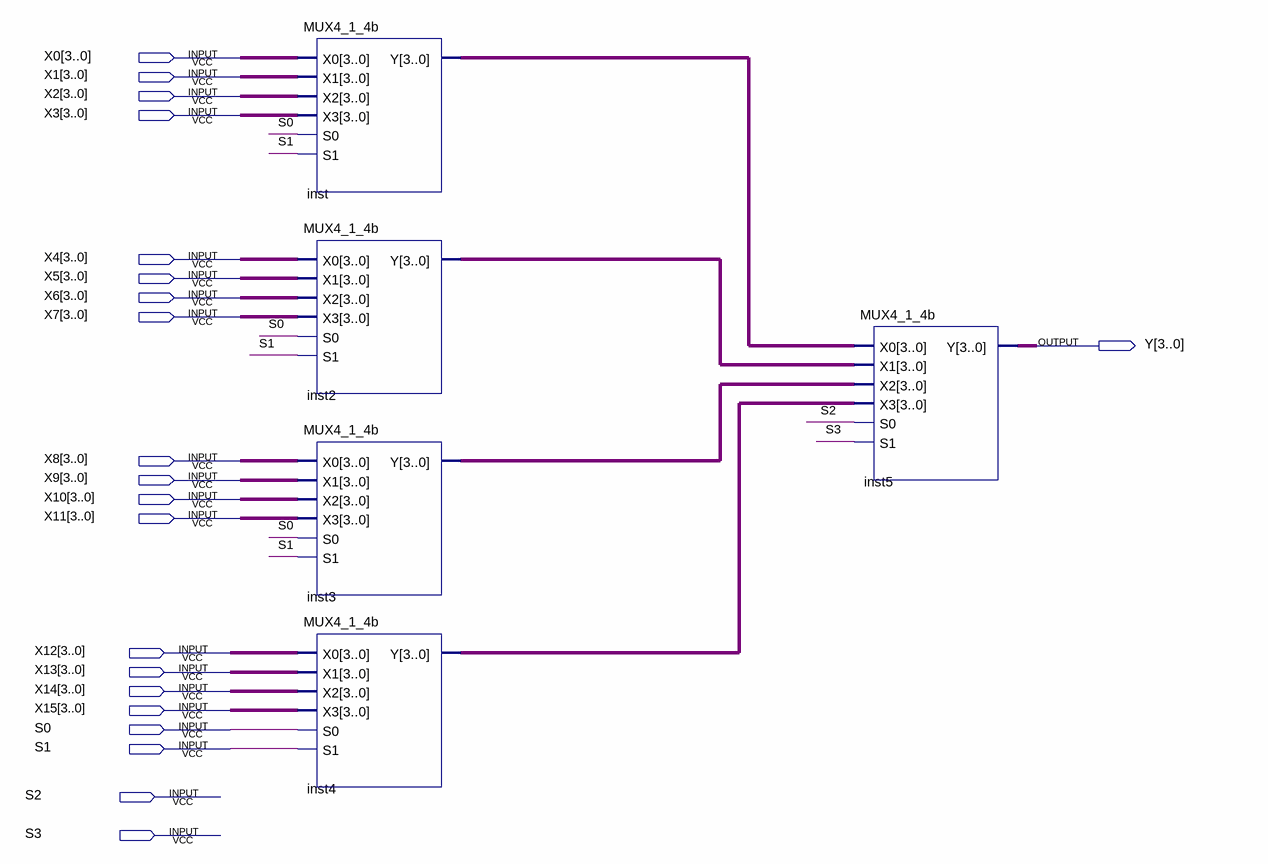
[diagram p0: schematic sheet]
// Quartus schematic MUX16_1_4b.bdf as structural Verilog: 5 symbols, 21 pins
module MUX16_1_4b (
  input  [3:0] X0,
  input  [3:0] X1,
  input  [3:0] X2,
  input  [3:0] X3,
  input  [3:0] X4,
  input  [3:0] X5,
  input  [3:0] X6,
  input  [3:0] X7,
  input  [3:0] X8,
  input  [3:0] X9,
  input  [3:0] X10,
  input  [3:0] X11,
  input  [3:0] X12,
  input  [3:0] X13,
  input  [3:0] X14,
  input  [3:0] X15,
  input  S0,
  input  S1,
  input  S2,
  input  S3,
  output [3:0] Y
);

  wire [3:0] inst2_y, inst3_y, inst4_y, inst_y;

  MUX4_1_4b inst (.X0(X0), .X1(X1), .X2(X2), .X3(X3), .S0(S0), .S1(S1), .Y(inst_y));
  MUX4_1_4b inst2 (.X0(X4), .X1(X5), .X2(X6), .X3(X7), .S0(S0), .S1(S1), .Y(inst2_y));
  MUX4_1_4b inst3 (.X0(X8), .X1(X9), .X2(X10), .X3(X11), .S0(S0), .S1(S1), .Y(inst3_y));
  MUX4_1_4b inst4 (.X0(X12), .X1(X13), .X2(X14), .X3(X15), .S0(S0), .S1(S1), .Y(inst4_y));
  MUX4_1_4b inst5 (.X0(inst_y), .X1(inst2_y), .X2(inst3_y), .X3(inst4_y), .S0(S2), .S1(S3), .Y(Y));
endmodule
